# Altium schematic sheet GLIDE.SchDoc
size 246 x 182 mm
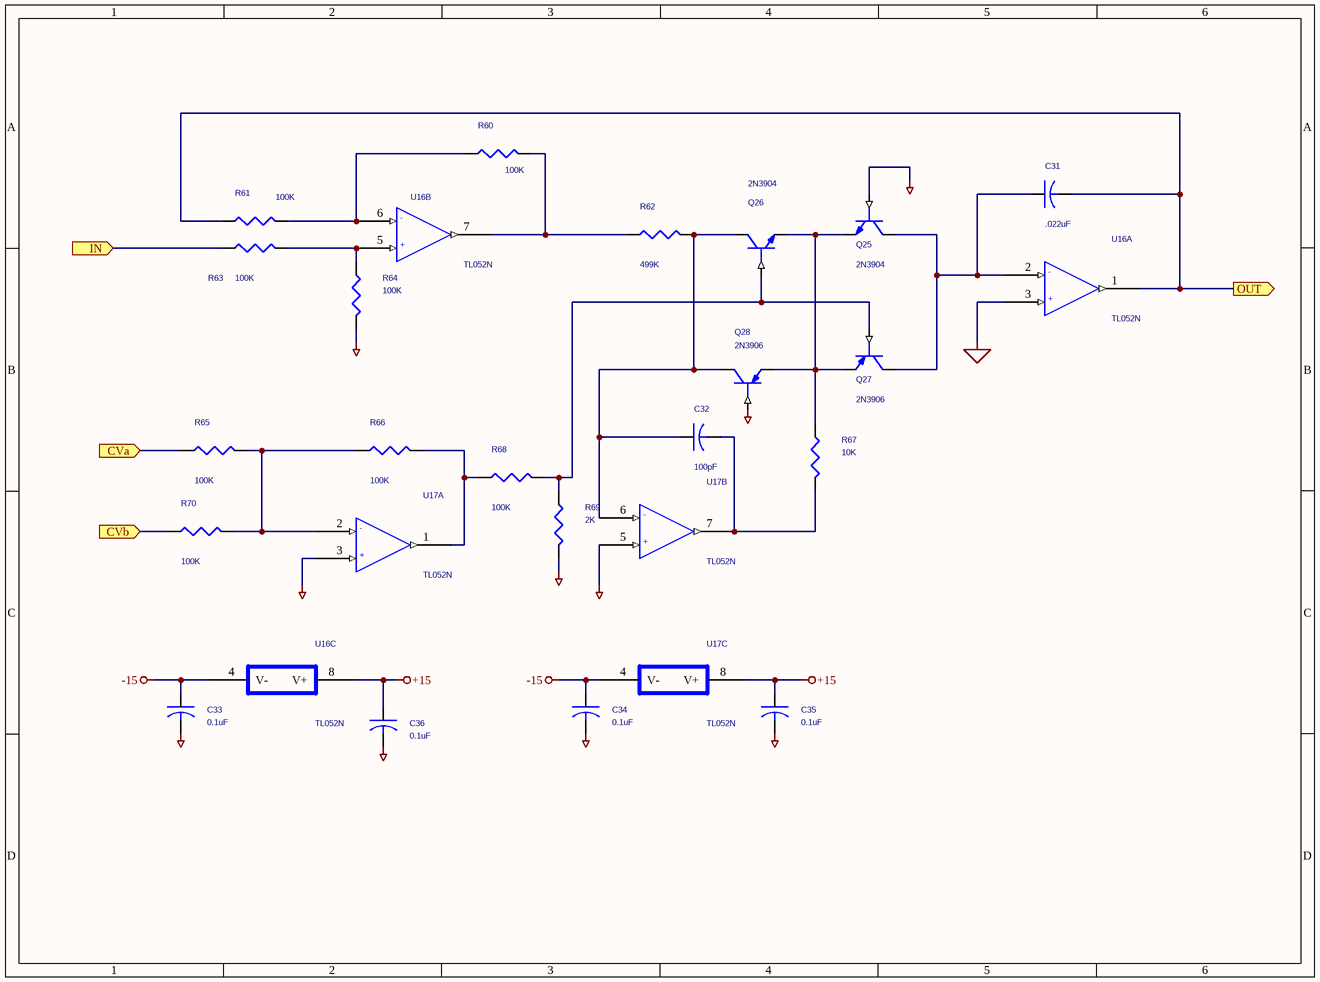
[diagram p0: GLIDE.SchDoc]

## Parts
C31  .022uF  [CAP-MY0.2X.1]
C32  100pF  [RAD0.1]
C33  0.1uF  [AXIALCAP0.3]
C34  0.1uF  [AXIALCAP0.3]
C35  0.1uF  [AXIALCAP0.3]
C36  0.1uF  [AXIALCAP0.3]
Q25  2N3904  [TO92]
Q26  2N3904  [TO92]
Q27  2N3906  [TO92]
Q28  2N3906  [TO92]
R60  100K  [AXIAL0.4]
R61  100K  [AXIAL0.4]
R62  499K  [AXIAL0.4]
R63  100K  [AXIAL0.4]
R64  100K  [AXIAL0.4]
R65  100K  [AXIAL0.4]
R66  100K  [AXIAL0.4]
R67  10K  [AXIAL0.4]
R68  100K  [AXIAL0.4]
R69  2K  [AXIAL0.4]
R70  100K  [AXIAL0.4]
U16  TL052N  [DIP8]  (parts A,B,C of 3)
U17  TL052N  [DIP8]  (parts A,B,C of 3)

## Ports
CVa (in), CVb (in), IN (in), OUT (out)

## Nets
+15: C35.1 C36.1 U16.8(V+) U17.8(V+)
-15: C33.1 C34.1 U16.4(V-) U17.4(V-)
AGND: C33.2 C34.2 C35.2 C36.2 Q25.BASE Q28.BASE R64.2 R69.2 U17.3(+) U17.5(+)
GND_SIGNAL: U16.3(+)
CVa: R65.1 ; port CVa
CVb: R70.1 ; port CVb
IN: R63.1 ; port IN
OUT: C31.2 R61.1 U16.1(OUT) ; port OUT
NetC31_1: C31.1 Q25.COLLECTOR Q27.COLLECTOR U16.2(-)
NetC32_1: C32.1 Q26.COLLECTOR Q28.COLLECTOR R62.2 U17.6(-)
NetC32_2: C32.2 R67.2 U17.7(OUT)
NetQ25_EMITTER: Q25.EMITTER Q26.EMITTER Q27.EMITTER Q28.EMITTER R67.1
NetQ26_BASE: Q26.BASE Q27.BASE R68.2 R69.1
NetR60_1: R60.1 R61.2 U16.6(-)
NetR60_2: R60.2 R62.1 U16.7(OUT)
NetR63_2: R63.2 R64.1 U16.5(+)
NetR65_2: R65.2 R66.1 R70.2 U17.2(-)
NetR66_2: R66.2 R68.1 U17.1(OUT)

## Library data of the parts
C31-C36 = CAP_Dup1
  C31: DIGIKEY PN: P4717-ND
  C32: MOUSER PN: 140-50P2-101K-RC
Q25 Q26 = NPN: DIGIKEY PN: 2N3904FS-ND
Q27 Q28 = PNP: DIGIKEY PN: 2N3906FS-ND
R60-R70 = R_Dup1
  R60 R61 R63-R66 R68 R70: MOUSER PN: 271-100K-RC
  R62: MOUSER PN: 271-499K-RC
  R67: MOUSER PN: 271-10K-RC
  R69: MOUSER PN: 271-2K-RC
U16 U17 = TL052N: DIGIKEY PN: 296-7163-5-ND
  U16: PACKAGE: GLIDE_1
  U17: PACKAGE: GLIDE_2